# EAGLE design USBready (EAGLE 7.2.0)
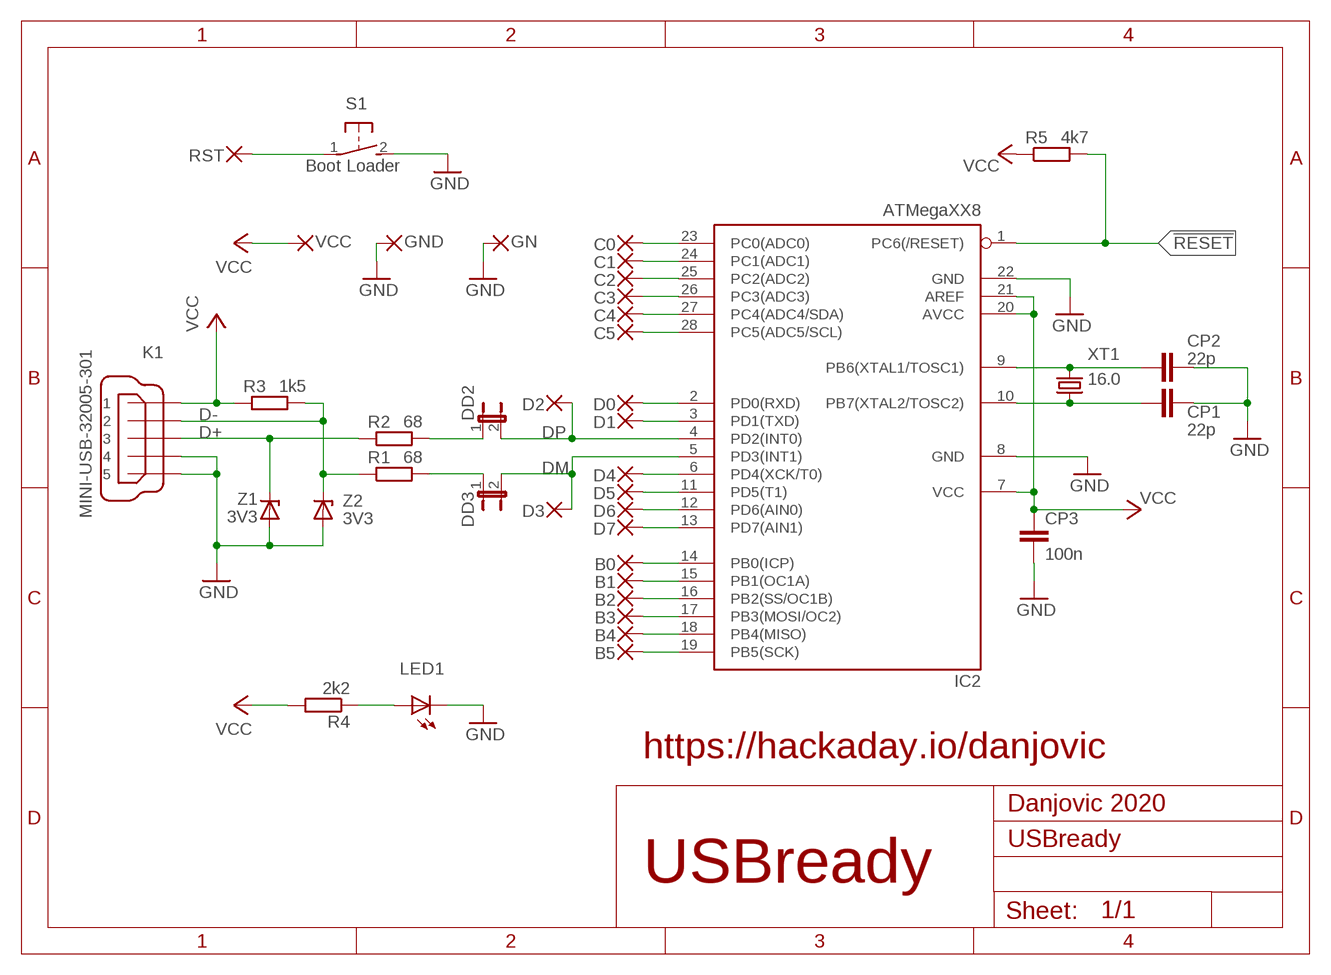
[diagram p0: schematic, sheet 1]

## Parts
B0  WIREPAD1,6/0,9  [1,6/0,9]
B1  WIREPAD1,6/0,9  [1,6/0,9]
B2  WIREPAD1,6/0,9  [1,6/0,9]
B3  WIREPAD1,6/0,9  [1,6/0,9]
B4  WIREPAD1,6/0,9  [1,6/0,9]
B5  WIREPAD1,6/0,9  [1,6/0,9]
C0  WIREPAD1,6/0,9  [1,6/0,9]
C1  WIREPAD1,6/0,9  [1,6/0,9]
C2  WIREPAD1,6/0,9  [1,6/0,9]
C3  WIREPAD1,6/0,9  [1,6/0,9]
C4  WIREPAD1,6/0,9  [1,6/0,9]
C5  WIREPAD1,6/0,9  [1,6/0,9]
CP1  22p  C-EUC0805  [C0805]
CP2  22p  C-EUC0805  [C0805]
CP3  100n  C-EUC0805  [C0805]
D0  WIREPAD1,6/0,9  [1,6/0,9]
D1  WIREPAD1,6/0,9  [1,6/0,9]
D2  WIREPAD1,6/0,9  [1,6/0,9]
D3  WIREPAD1,6/0,9  [1,6/0,9]
D4  WIREPAD1,6/0,9  [1,6/0,9]
D5  WIREPAD1,6/0,9  [1,6/0,9]
D6  WIREPAD1,6/0,9  [1,6/0,9]
D7  WIREPAD1,6/0,9  [1,6/0,9]
DD2  JP1E  [JP1]
DD3  JP1E  [JP1]
GN  WIREPAD1,6/0,9  [1,6/0,9]
GND  WIREPAD1,6/0,9  [1,6/0,9]
IC2  ATMegaXX8  MEGA8-P  [DIL28-3]
K1  MINI-USB-32005-301  [32005-301]
LED1  LEDSML1206  [SML1206]
R1  68  R-EU_M0805  [M0805]
R2  68  R-EU_M0805  [M0805]
R3  1k5  R-EU_R0805  [R0805]
R4  2k2  R-EU_R0805  [R0805]
R5  4k7  R-EU_M0805  [M0805]
RST  WIREPAD1,6/0,9  [1,6/0,9]
S1  31-XX  [B3F-31XX]
VCC  WIREPAD1,6/0,9  [1,6/0,9]
XT1  16.0  CRYSTALHC49S  [HC49/S]
Z1  3V3  ZENER-DIODESOD80C  [SOD80C]
Z2  3V3  ZENER-DIODESOD80C  [SOD80C]

## Nets
!RESET: IC2.1(PC6(/RESET)) R5.2 RST.1(P) S1.1(P)
AN2: C2.1(P) IC2.25(PC2(ADC2))
AN3: C3.1(P) IC2.26(PC3(ADC3))
D+: K1.3 R2.1 Z1.C
D-: K1.2 R1.1 R3.2 Z2.C
DM: D3.1(P) DD3.2 IC2.5(PD3(INT1))
DP: D2.1(P) DD2.2 IC2.4(PD2(INT0))
GND: CP1.2 CP2.2 CP3.2 GN.1(P) GND.1(P) IC2.8(GND) IC2.22(GND) K1.4 K1.5 LED1.C S1.2(S) Z1.A Z2.A
N$1: D0.1(P) IC2.2(PD0(RXD))
N$2: D4.1(P) IC2.6(PD4(XCK/T0))
N$3: C1.1(P) IC2.24(PC1(ADC1))
N$4: C0.1(P) IC2.23(PC0(ADC0))
N$5: C4.1(P) IC2.27(PC4(ADC4/SDA))
N$6: C5.1(P) IC2.28(PC5(ADC5/SCL))
N$7: D1.1(P) IC2.3(PD1(TXD))
N$8: D5.1(P) IC2.11(PD5(T1))
N$9: D6.1(P) IC2.12(PD6(AIN0))
N$10: D7.1(P) IC2.13(PD7(AIN1))
N$11: LED1.A R4.1
N$12: B0.1(P) IC2.14(PB0(ICP))
N$13: B2.1(P) IC2.16(PB2(SS/OC1B))
N$14: B1.1(P) IC2.15(PB1(OC1A))
N$15: B5.1(P) IC2.19(PB5(SCK))
N$16: B4.1(P) IC2.18(PB4(MISO))
N$17: B3.1(P) IC2.17(PB3(MOSI/OC2))
N$18: DD2.1 R2.2
N$19: DD3.1 R1.2
VCC: CP3.1 IC2.7(VCC) IC2.20(AVCC) IC2.21(AREF) K1.1 R3.1 R4.2 R5.1 VCC.1(P)
X1: CP2.1 IC2.9(PB6(XTAL1/TOSC1)) XT1.2
X2: CP1.1 IC2.10(PB7(XTAL2/TOSC2)) XT1.1

## Notes on the sheet
- Boot Loader
- https://hackaday.io/danjovic
- Danjovic 2020
- USBready

## Library data of the parts
B0 B1-B5 C0 C1-C5 D0 D1-D7 GN GND RST VCC = wirepad:WIREPAD: Wire PAD connect wire on PCB
CP1-CP3 = rcl:C-EU: CAPACITOR, European symbol
DD2 DD3 = jumper:JP1E: JUMPER
IC2 = atmel:MEGA8-P: MICROCONTROLLER 8 Kbytes FLASH, 1 kbytes SRAM, 512 bytes EEPROM, USART, 4-channel 10 bit ADC, 2-channel 8 bit ADC Pin compatible with Atmega48, ATMega88, ATMega168 Source: avr.lbr; OC_FARNELL: unknown; OC_NEWARK: unknown
K1 = con-cypressindustries:MINI-USB-: MINI USB-B Conector Source: www.cypressindustries.com; OC_FARNELL: unknown; OC_NEWARK: unknown
LED1 = led:LED: LED OSRAM: - CHIPLED LG R971, LG N971, LY N971, LG Q971, LY Q971, LO R971, LY R971 LH N974, LH R974 LS Q976, LO Q976, LY Q976 LO Q996 - Hyper CHIPLED LW Q18S LB Q993, LB Q99A, LB R99A - SideLED LS A670, LO A670, LY A670, LG A670, LP A670 LB A673, LV A673, LT A673, LW A673 LH A674 LY A675 LS A676, LA A676, LO A676, LY A676, LW A676 LS A679, LY A679, LG A679 - Hyper Micro SIDELED® LS Y876, LA Y876, LO Y876, LY Y876 LT Y87S - SmartLED LW L88C, LW L88S LB L89C, LB L89S, LG L890 LS L89K, LO L89K, LY L89K LS L896, LA L896, LO L896, LY L896 - TOPLED LS T670, LO T670, LY T670, LG T670, LP T670 LSG T670, LSP T670, LSY T670, LOP T670, LYG T670 LG T671, LOG T671, LSG T671 LB T673, LV T673, LT T673, LW T673 LH T674 LS T676, LA T676, LO T676, LY T676, LB T676, LH T676, LSB T676, LW T676 LB T67C, LV T67C, LT T67C, LS T67K, LO T67K, LY T67K, LW E67C LS E67B, LA E67B, LO E67B, LY E67B, LB E67C, LV E67C, LT E67C LW T67C LS T679, LY T679, LG T679 LS T770, LO T770, LY T770, LG T770, LP T770 LB T773, LV T773, LT T773, LW T773 LH T774 LS E675, LA E675, LY E675, LS T675 LS T776, LA T776, LO T776, LY T776, LB T776 LHGB T686 LT T68C, LB T68C - Hyper Mini TOPLED® LB M676 - Mini TOPLED Santana® LG M470 LS M47K, LO M47K, LY M47K Source: http://www.osram.convergy.de LUXEON: - LUMILED® LXK2-PW12-R00, LXK2-PW12-S00, LXK2-PW14-U00, LXK2-PW14-V00 LXK2-PM12-R00, LXK2-PM12-S00, LXK2-PM14-U00 LXK2-PE12-Q00, LXK2-PE12-R00, LXK2-PE12-S00, LXK2-PE14-T00, LXK2-PE14-U00 LXK2-PB12-K00, LXK2-PB12-L00, LXK2-PB12-M00, LXK2-PB14-N00, LXK2-PB14-P00, LXK2-PB14-Q00 LXK2-PR12-L00, LXK2-PR12-M00, LXK2-PR14-Q00, LXK2-PR14-R00 LXK2-PD12-Q00, LXK2-PD12-R00, LXK2-PD12-S00 LXK2-PH12-R00, LXK2-PH12-S00 LXK2-PL12-P00, LXK2-PL12-Q00, LXK2-PL12-R00 Source: www.luxeon.com KINGBRIGHT: KA-3528ASYC Source: www.kingbright.com
R1-R5 = rcl:R-EU_: RESISTOR, European symbol
S1 = switch-omron:31-XX: OMRON SWITCH; MPN: B3F-3100; OC_FARNELL: 959704; OC_NEWARK: 36M3582
XT1 = crystal:CRYSTAL: CRYSTAL; OC_FARNELL: 1667008; OC_NEWARK: unknown
Z1 Z2 = diode:ZENER-DIODE: Z-Diode

## Board
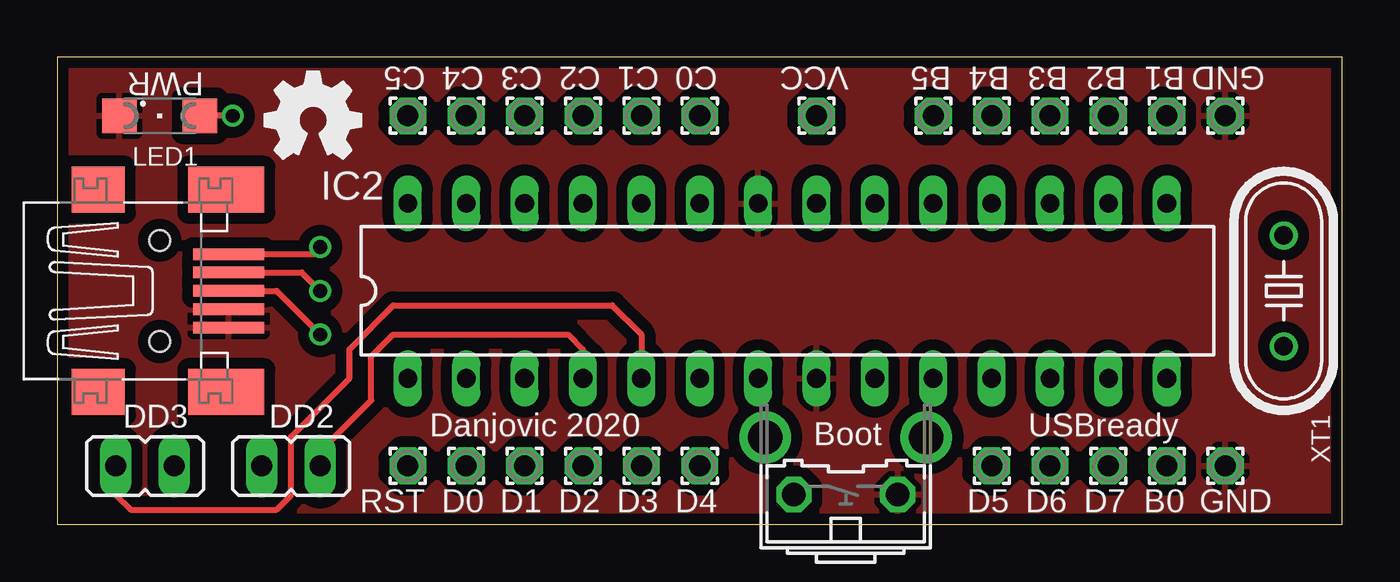
[diagram p1: board, top side]
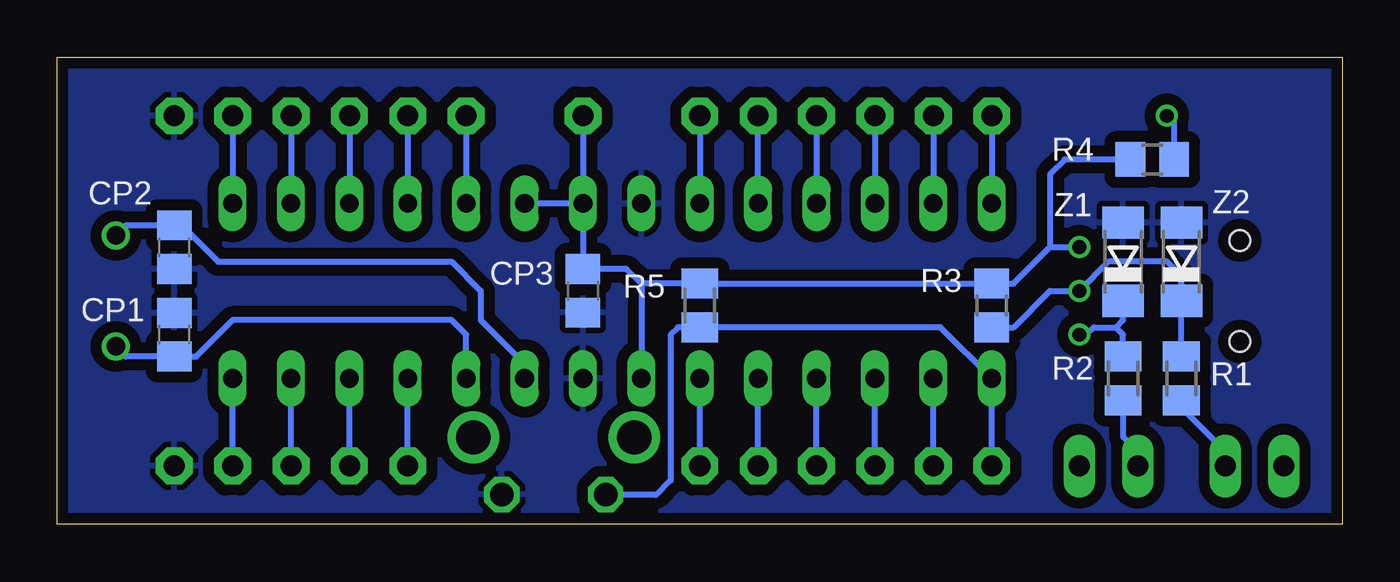
[diagram p2: board, bottom side, seen from below]

Size 55.88 x 20.32 mm. Coordinates in mm from the lower left corner, seen from the top.
Outline: 0,0 55.88,0 55.88,20.32 0,20.32 0,0
Copper layers (1*16): Top 0.0356mm / dielectric 1.5011mm / Bottom 0.0356mm
Design rules "LaenPCBOrder *": minimum track width 6mil, minimum drill 13mil, track to track 6mil, track to pad 6mil, pad to pad 6mil, via to via 6mil, smd to smd 6mil, copper to edge 15mil, drill to drill 6mil, minimum pad ring 7mil, minimum via ring 7mil, stop-mask expansion 3mil, vias tented up to drill 0mil, thermal gap 10mil

### Footprints (pad centres in the part's own frame; a part is rotated, then mirrored left to right if it is on the bottom)
1,6/0,9 = drill 0.914 pad 1.6 octagon: 1 0,0
C0805 = smd 1.3 x 1.5: 1 -0.95,0; 2 0.95,0
JP1 = drill 0.914 long: 1 0,-1.27; 2 0,1.27
DIL28-3 = drill 0.813 long: 1 -16.51,-3.81; 2 -13.97,-3.81; 3 -11.43,-3.81; 4 -8.89,-3.81; 5 -6.35,-3.81; 6 -3.81,-3.81; 7 -1.27,-3.81; 8 1.27,-3.81; 9 3.81,-3.81; 10 6.35,-3.81; 11 8.89,-3.81; 12 11.43,-3.81; 13 13.97,-3.81; 14 16.51,-3.81; 15 16.51,3.81; 16 13.97,3.81; 17 11.43,3.81; 18 8.89,3.81; 19 6.35,3.81; 20 3.81,3.81; 21 1.27,3.81; 22 -1.27,3.81; 23 -3.81,3.81; 24 -6.35,3.81; 25 -8.89,3.81; 26 -11.43,3.81; 27 -13.97,3.81; 28 -16.51,3.81
32005-301 = smd 3.1 x 0.5: 1 3,1.6; 2 3,0.8; 3 3,0; 4 3,-0.8; 5 3,-1.6 | smd 2.297 x 2: M1 -2.667,-4.399; M2 -2.667,4.399 | smd 3.3 x 2: M3 2.9,4.399; M4 2.9,-4.399 | hole 0.9: 0,2.2; 0,-2.2
SML1206 = smd 1.5 x 1.5: A 1.75,0; C -1.75,0
M0805 = smd 1.3 x 1.6: 1 -0.95,0; 2 0.95,0
R0805 = smd 1.3 x 1.5: 1 -0.95,0; 2 0.95,0
B3F-31XX = drill 1.016 octagon: 1 -2.261,-1.245; 2 2.261,-1.245 | drill 1.499 pad 2.159: 3 -3.505,1.245; 4 3.505,1.245
HC49/S = drill 0.813: 1 -2.413,0; 2 2.413,0
SOD80C = smd 1.4 x 1.8: A 1.7,0; C -1.7,0

### Placement (x,y rotation side)
B0  48.26,2.54 180 top
B1  48.26,17.78 0 top
B2  45.72,17.78 0 top
B3  43.18,17.78 0 top
B4  40.64,17.78 0 top
B5  38.1,17.78 0 top
C0  27.94,17.78 0 top
C1  25.4,17.78 0 top
C2  22.86,17.78 0 top
C3  20.32,17.78 0 top
C4  17.78,17.78 0 top
C5  15.24,17.78 0 top
CP1  50.8,8.26 90 bottom
CP2  50.8,12.06 270 bottom
CP3  33.02,10.16 270 bottom
D0  17.78,2.54 180 top
D1  20.32,2.54 180 top
D2  22.86,2.54 180 top
D3  25.4,2.54 180 top
D4  27.94,2.54 180 top
D5  40.64,2.54 180 top
D6  43.18,2.54 180 top
D7  45.72,2.54 180 top
DD2  10.16,2.54 270 top
DD3  3.81,2.54 90 top
GN  50.8,17.78 0 top
GND  50.8,2.54 270 top
IC2  31.75,10.16 0 top
K1  4.45,10.16 0 top
LED1  4.45,17.78 0 top
R1  6.99,6.35 270 bottom
R2  9.53,6.35 270 bottom
R3  15.24,9.53 270 bottom
R4  8.26,15.88 180 bottom
R5  27.94,9.53 270 bottom
RST  15.24,2.54 180 top
S1  34.29,2.54 0 top
VCC  33.02,17.78 0 top
XT1  53.34,10.16 90 top
Z1  9.53,11.43 90 bottom
Z2  6.99,11.43 90 bottom

### Tracks (layer width: path | path; a pad name or v marks a point on that pad's centre or on a via)
!RESET
  Bottom 0.254: RST.1 IC2.1 17.46,8.57 R5.2 28.89,8.57 29.21,8.26 29.21,1.91 29.84,1.27 29.87,1.29 S1.1
AN2
  Bottom 0.254: C2.1 IC2.25
AN3
  Bottom 0.254: C3.1 IC2.26
D+  (via drill 0.6)
  Top 0.254: K1.3 9.53,10.16 v11.43,8.26
  Bottom 0.254: v11.43,8.26 11.11,8.26 10.79,8.57 9.84,8.57 | 9.84,8.57 9.53,8.89 Z1.C | R2.1 9.53,8.26 9.84,8.57
D-  (via drill 0.6)
  Top 0.254: K1.2 10.63,10.96 v11.43,10.16
  Bottom 0.254: R1.1 Z2.C 6.99,10.79 7.62,11.43 10.16,11.43 v11.43,10.16 12.7,10.16 14.29,8.57 R3.2
DM
  Top 0.254: DD3.2 2.54,1.27 3.17,0.64 9.53,0.64 10.16,1.27 10.16,3.81 12.7,6.35 12.7,7.62 14.61,9.53 24.13,9.53 25.4,8.26 IC2.5
  Bottom 0.254: D3.1 IC2.5
DP
  Top 0.254: DD2.2 11.43,3.17 13.65,5.4 13.65,7.3 14.61,8.26 22.23,8.26 22.86,7.62 IC2.4
  Bottom 0.254: D2.1 IC2.4
GND
  pour Top (isolate 0.483): 0,0 0,20.32 55.88,20.32 55.88,0
  pour Bottom (isolate 0.483): 55.88,20.32 55.88,0 0,0 0,20.32
N$1
  Bottom 0.254: D0.1 IC2.2
N$2
  Bottom 0.254: D4.1 IC2.6
N$3
  Bottom 0.254: IC2.24 C1.1
N$4
  Bottom 0.254: C0.1 IC2.23
N$5
  Bottom 0.254: C4.1 IC2.27
N$6
  Bottom 0.254: C5.1 IC2.28
N$7
  Bottom 0.254: D1.1 IC2.3
N$8
  Bottom 0.254: D5.1 IC2.11
N$9
  Bottom 0.254: D6.1 IC2.12
N$10
  Bottom 0.254: D7.1 IC2.13
N$11  (via drill 0.6)
  Top 0.254: v7.62,17.78 LED1.A
  Bottom 0.254: R4.1 7.3,17.46 v7.62,17.78
N$12
  Bottom 0.254: B0.1 IC2.14
N$13
  Bottom 0.254: B2.1 IC2.16
N$14
  Bottom 0.254: B1.1 IC2.15
N$15
  Bottom 0.254: B5.1 IC2.19
N$16
  Bottom 0.254: B4.1 IC2.18
N$17
  Bottom 0.254: B3.1 IC2.17
N$18
  Bottom 0.254: R2.2 9.53,3.81 8.89,3.17 DD2.1
N$19
  Bottom 0.254: R1.2 6.99,5.08 5.08,3.17 DD3.1
VCC  (via drill 0.6)
  Top 0.254: K1.1 11.12,11.76 v11.43,12.06
  Bottom 0.254: 12.7,12.06 14.29,10.47 R3.1 R5.1 30.48,10.47 | 12.7,12.06 v11.43,12.06 | IC2.21 CP3.1 31.11,11.11 30.48,10.47 | IC2.21 IC2.20 | R4.2 12.06,15.88 12.7,15.24 12.7,12.06 | VCC.1 IC2.21 | 30.48,10.47 IC2.7
X1
  Bottom 0.254: XT1.2 52.9,13.02 CP2.1 50.48,13.02 48.9,11.43 38.73,11.43 37.47,10.16 37.47,8.89 35.56,6.99 IC2.9
X2
  Bottom 0.254: IC2.10 38.1,8.26 38.73,8.89 48.26,8.89 49.84,7.3 CP1.1 52.9,7.3 XT1.1

### Text on the board
tPlace: PWR | D | Danjovic 2020 | USBready
tNames: Boot